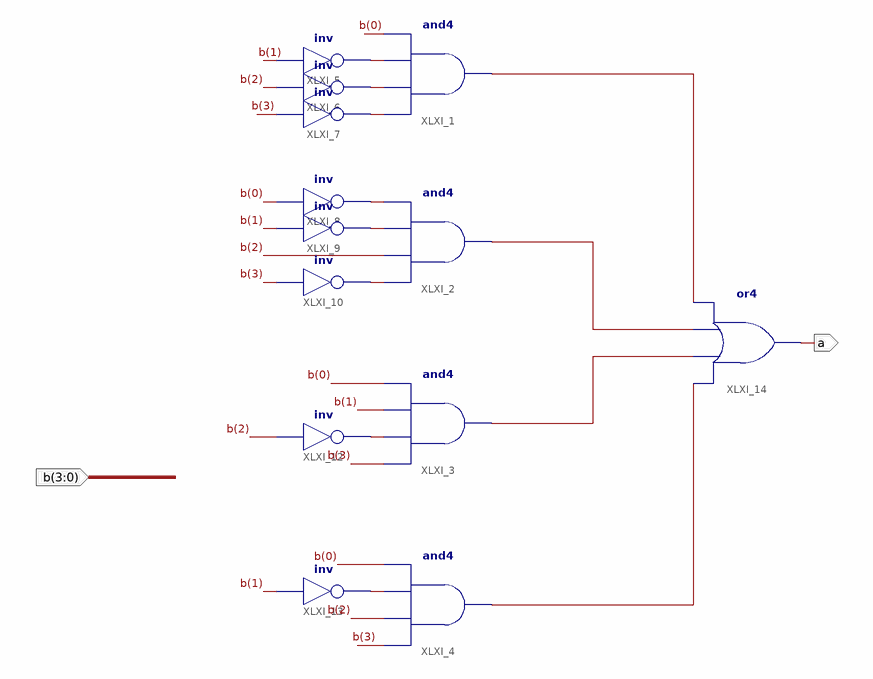
[diagram p0: schematic sheet 1]
// Xilinx ISE schematic a.sch (artix7) as structural Verilog: 13 symbols, 2 ports
module a (
  input  [3:0] b,
  output a
);

  wire XLXN_2, XLXN_3, XLXN_4, XLXN_5, XLXN_6, XLXN_7, XLXN_8, XLXN_9, XLXN_26, XLXN_27, XLXN_28, XLXN_29;

  and XLXI_1 (XLXN_26, XLXN_4, XLXN_3, XLXN_2, b[0]);
  and XLXI_2 (XLXN_27, XLXN_7, b[2], XLXN_6, XLXN_5);
  and XLXI_3 (XLXN_28, b[3], XLXN_8, b[1], b[0]);
  and XLXI_4 (XLXN_29, b[3], b[2], XLXN_9, b[0]);
  not XLXI_5 (XLXN_2, b[1]);
  not XLXI_6 (XLXN_3, b[2]);
  not XLXI_7 (XLXN_4, b[3]);
  not XLXI_8 (XLXN_5, b[0]);
  not XLXI_9 (XLXN_6, b[1]);
  not XLXI_10 (XLXN_7, b[3]);
  not XLXI_12 (XLXN_8, b[2]);
  not XLXI_13 (XLXN_9, b[1]);
  or XLXI_14 (a, XLXN_29, XLXN_28, XLXN_27, XLXN_26);
endmodule
